# EAGLE design ISP_Arduino_Board (EAGLE 7.6.0)
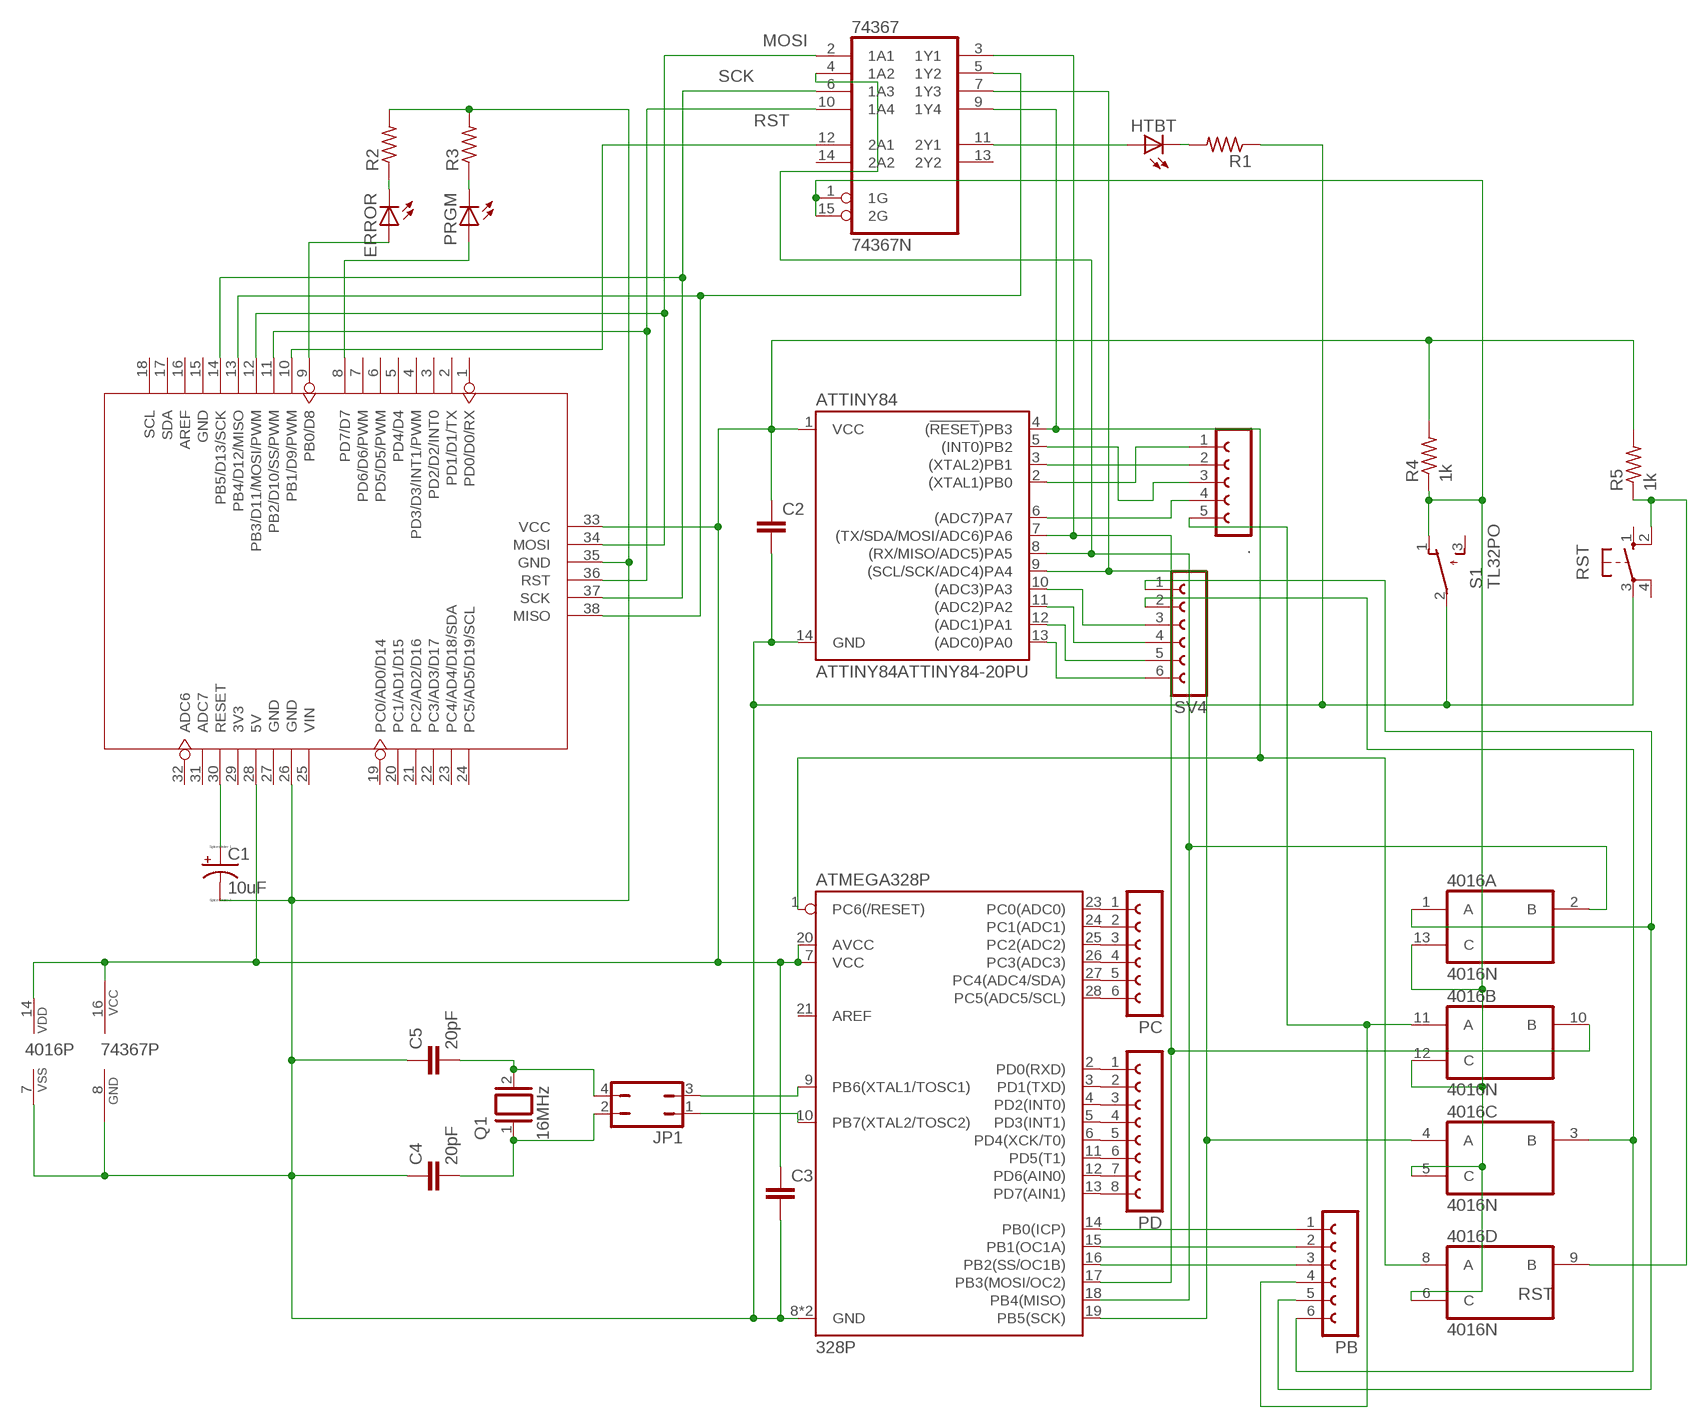
[diagram p0: schematic, sheet 1]

## Parts
4016  4016N  [DIL14]
74367  74367N  [DIL16]
.  FE05-1  [FE05-1]
ATMEGA328P  328P  ATMEGA328P_PDIP  [DIP28]
ATTINY84  ATTINY84ATTINY84-20PU  [DIP14]
C1  10uF  CPOL-USE2.5-6  [E2,5-6]
C2  C2,5-3  [C2.5-3]
C3  C2,5-3  [C2.5-3]
C4  20pF  C2,5-3  [C2.5-3]
C5  20pF  C2,5-3  [C2.5-3]
ERROR  LED3MM  [LED3MM]
HTBT  LED3MM  [LED3MM]
JP1  JP2Q  [JP2Q]
PB  FE06-1  [FE06]
PC  FE06-1  [FE06]
PD  FE08-1  [FE08]
PRGM  LED3MM  [LED3MM]
Q1  16MHz  XTAL/S  [QS]
R1  R-US_0207/10  [0207/10]
R2  R-US_0207/10  [0207/10]
R3  R-US_0207/10  [0207/10]
R4  1k  R-US_0207/10  [0207/10]
R5  1k  R-US_0207/10  [0207/10]
RST  10-XX  [B3F-10XX]
S1  TL32PO  [TL3XPO]
SV4  FE06-1  [FE06]
U2  DIP Long Blue Female Header  ARDUINO-38P  [ARDUINO-38P]

## Nets
GND: 4016.7(P:VSS) 74367.8(GND) ATMEGA328P.8(GND) ATMEGA328P.22(GND) ATTINY84.14(GND) C1.- C2.2 C3.2 C4.1 C5.1 R1.1 R2.2 R3.2 RST.3(P) S1.2(P) U2.26(GND) U2.35(GND)
N$1: 4016.14(P:VDD) 74367.16(VCC) ATMEGA328P.7(VCC) ATMEGA328P.20(AVCC) ATTINY84.1(VCC) C2.1 C3.1 R4.2 R5.2 U2.28(5V) U2.33(VCC)
N$2: 4016.11(B:A) ..5 PB.4
N$3: 4016.4(C:A) 74367.7(1Y3) ATMEGA328P.19(PB5(SCK)) ATTINY84.9((SCL/SCK/ADC4)PA4)
N$4: C1.+ U2.30(RESET)
N$5: 4016.2(A:B) 74367.4(1A2) ATMEGA328P.18(PB4(MISO)) ATTINY84.8((RX/MISO/ADC5)PA5)
N$6: ATMEGA328P.14(PB0(ICP)) PB.1
N$7: PRGM.K(C) R3.1
N$8: C5.2 JP1.4 Q1.2
N$10: ERROR.K(C) R2.1
N$11: HTBT.K(C) R1.2
N$12: 74367.12(2A1) U2.10(PB1/D9/PWM)
N$13: 74367.2(1A1) U2.12(PB3/D11/MOSI/PWM) U2.34(MOSI)
N$14: PRGM.A U2.8(PD7/D7)
N$15: 74367.9(1Y4) ATMEGA328P.1(PC6(/RESET)) ATTINY84.4((!RESET!)PB3)
N$16: C4.2 JP1.2 Q1.1
N$17: ATMEGA328P.9(PB6(XTAL1/TOSC1)) JP1.3
N$18: ATMEGA328P.10(PB7(XTAL2/TOSC2)) JP1.1
N$19: ERROR.A U2.9(PB0/D8)
N$20: 74367.10(1A4) U2.11(PB2/D10/SS/PWM) U2.36(RST)
N$21: 74367.5(1Y2) U2.13(PB4/D12/MISO) U2.38(MISO)
N$22: 74367.6(1A3) U2.14(PB5/D13/SCK) U2.37(SCK)
N$23: ATMEGA328P.2(PD0(RXD)) PD.1
N$24: ATMEGA328P.3(PD1(TXD)) PD.2
N$25: 4016.5(C:C) 4016.6(D:C) 4016.12(B:C) 4016.13(A:C) 74367.1(1G) 74367.15(2G) R4.1 S1.1(O)
N$26: ATMEGA328P.23(PC0(ADC0)) PC.1
N$27: ATMEGA328P.24(PC1(ADC1)) PC.2
N$28: ATMEGA328P.25(PC2(ADC2)) PC.3
N$29: ATMEGA328P.26(PC3(ADC3)) PC.4
N$30: ATMEGA328P.27(PC4(ADC4/SDA)) PC.5
N$31: ATMEGA328P.28(PC5(ADC5/SCL)) PC.6
N$32: ATMEGA328P.4(PD2(INT0)) PD.3
N$33: ATMEGA328P.5(PD3(INT1)) PD.4
N$34: ATMEGA328P.6(PD4(XCK/T0)) PD.5
N$35: ATMEGA328P.11(PD5(T1)) PD.6
N$36: ATMEGA328P.12(PD6(AIN0)) PD.7
N$37: ATMEGA328P.13(PD7(AIN1)) PD.8
N$38: ATMEGA328P.15(PB1(OC1A)) PB.2
N$39: ATMEGA328P.16(PB2(SS/OC1B)) PB.3
N$40: 4016.3(C:B) PB.6 SV4.2
N$41: 4016.1(A:A) PB.5 SV4.1
N$43: 4016.9(D:B) R5.1 RST.2(S1)
N$44: 74367.11(2Y1) HTBT.A
N$45: ..1 ATTINY84.2((XTAL1)PB0)
N$46: ..2 ATTINY84.3((XTAL2)PB1)
N$47: ..3 ATTINY84.5((INT0)PB2)
N$48: ..4 ATTINY84.6((ADC7)PA7)
N$49: ATTINY84.13((ADC0)PA0) SV4.6
N$50: ATTINY84.12((ADC1)PA1) SV4.5
N$51: ATTINY84.11((ADC2)PA2) SV4.4
N$52: ATTINY84.10((ADC3)PA3) SV4.3
PD: 4016.10(B:B) 74367.3(1Y1) ATMEGA328P.17(PB3(MOSI/OC2)) ATTINY84.7((TX/SDA/MOSI/ADC6)PA6)
Unconnected: 4016.8(D:A) 74367.13(2Y2) 74367.14(2A2) ATMEGA328P.21(AREF) RST.1(S) RST.4(P1) S1.3(S) U2.1(PD0/D0/RX) U2.2(PD1/D1/TX) U2.3(PD2/D2/INT0) U2.4(PD3/D3/INT1/PWM) U2.5(PD4/D4) U2.6(PD5/D5/PWM) U2.7(PD6/D6/PWM) U2.15(GND) U2.16(AREF) U2.17(SDA) U2.18(SCL) U2.19(PC0/AD0/D14) U2.20(PC1/AD1/D15) U2.21(PC2/AD2/D16) U2.22(PC3/AD3/D17) U2.23(PC4/AD4/D18/SDA) U2.24(PC5/AD5/D19/SCL) U2.25(VIN) U2.27(GND) U2.29(3V3) U2.31(ADC7) U2.32(ADC6)

## Notes on the sheet
- MOSI
- SCK
- RST
- RST

## Library data of the parts
4016 = 40xx:4016: Quad bilateral ANALOG SWITCH
74367 = 74xx-us:74*367: Hex BUS DRIVER, 3-state
. = con-lsta:FE05-1: FEMALE HEADER; OC_FARNELL: unknown; OC_NEWARK: unknown
ATMEGA328P = SparkFun-IC-Microcontroller:ATMEGA328P_PDIP: Atmel 328P Through hole ATMEGA328P uC used in the Arduino 32kb flash, 1k EEPROM, 2k SRAM Datasheet <http://www.sparkfun.com/datasheets/Components/SMD/ATMega328.pdf> SparkFun Products Storefront component: AVR 28 Pin 20MHz 32K 6A/D - ATMega328P <https://www.sparkfun.com/products/9061> (COM-09061) SparkFun Simon Says - Through-Hole Soldering Kit <https://www.sparkfun.com/products/10547> (KIT-10547) SparkFun Learn to Solder - Simon Says <https://www.sparkfun.com/products/13708> (KIT-13708) SparkFun BigTime Watch Kit <https://www.sparkfun.com/products/11734> (KIT-11734) SparkFun ClockIt <https://www.sparkfun.com/products/10930> (KIT-10930) SparkFun Serial Enabled LCD Kit <https://www.sparkfun.com/products/10097> (LCD-10097) SparkFun Simon Tilts - Through Hole Soldering Kit <https://www.sparkfun.com/products/12634> (KIT-12634) SparkFun Frequency Counter Kit <https://www.sparkfun.com/products/10140> (KIT-10140) FabFM Radio Kit <https://www.sparkfun.com/products/11043> (KIT-11043) SparkFun Binary Blaster Kit <https://www.sparkfun.com/products/12037> (KIT-12037) SparkFun Metro-Gnome <https://www.sparkfun.com/products/9236> (KIT-09236) ATmega328 with Arduino Optiboot (Uno) <https://www.sparkfun.com/products/10524> (DEV-10524); PROD_ID: IC-09136
ATTINY84 = SparkFun-IC-Microcontroller:ATTINY84: Atmel 14-pin 2/4/8kB flash uC Datasheet <https://cdn.sparkfun.com/datasheets/Widgets/doc8006.pdf> SparkFun Products Tiny AVR Programmer <https://www.sparkfun.com/products/11801> (PGM-11801) SparkFun Servo Trigger - Continuous Rotation <https://www.sparkfun.com/products/13872> (WIG-13872) SparkFun Servo Trigger <https://www.sparkfun.com/products/13118> (WIG-13118)
C1 = resistor:CPOL-US: POLARIZED CAPACITOR, American symbol
C2-C5 = capacitor-wima:C: CAPACITOR naming: grid - package width
ERROR HTBT PRGM = led:LED: LED OSRAM: - CHIPLED LG R971, LG N971, LY N971, LG Q971, LY Q971, LO R971, LY R971 LH N974, LH R974 LS Q976, LO Q976, LY Q976 LO Q996 - Hyper CHIPLED LW Q18S LB Q993, LB Q99A, LB R99A - SideLED LS A670, LO A670, LY A670, LG A670, LP A670 LB A673, LV A673, LT A673, LW A673 LH A674 LY A675 LS A676, LA A676, LO A676, LY A676, LW A676 LS A679, LY A679, LG A679 - Hyper Micro SIDELED® LS Y876, LA Y876, LO Y876, LY Y876 LT Y87S - SmartLED LW L88C, LW L88S LB L89C, LB L89S, LG L890 LS L89K, LO L89K, LY L89K LS L896, LA L896, LO L896, LY L896 - TOPLED LS T670, LO T670, LY T670, LG T670, LP T670 LSG T670, LSP T670, LSY T670, LOP T670, LYG T670 LG T671, LOG T671, LSG T671 LB T673, LV T673, LT T673, LW T673 LH T674 LS T676, LA T676, LO T676, LY T676, LB T676, LH T676, LSB T676, LW T676 LB T67C, LV T67C, LT T67C, LS T67K, LO T67K, LY T67K, LW E67C LS E67B, LA E67B, LO E67B, LY E67B, LB E67C, LV E67C, LT E67C LW T67C LS T679, LY T679, LG T679 LS T770, LO T770, LY T770, LG T770, LP T770 LB T773, LV T773, LT T773, LW T773 LH T774 LS E675, LA E675, LY E675, LS T675 LS T776, LA T776, LO T776, LY T776, LB T776 LHGB T686 LT T68C, LB T68C - Hyper Mini TOPLED® LB M676 - Mini TOPLED Santana® LG M470 LS M47K, LO M47K, LY M47K Source: http://www.osram.convergy.de LUXEON: - LUMILED® LXK2-PW12-R00, LXK2-PW12-S00, LXK2-PW14-U00, LXK2-PW14-V00 LXK2-PM12-R00, LXK2-PM12-S00, LXK2-PM14-U00 LXK2-PE12-Q00, LXK2-PE12-R00, LXK2-PE12-S00, LXK2-PE14-T00, LXK2-PE14-U00 LXK2-PB12-K00, LXK2-PB12-L00, LXK2-PB12-M00, LXK2-PB14-N00, LXK2-PB14-P00, LXK2-PB14-Q00 LXK2-PR12-L00, LXK2-PR12-M00, LXK2-PR14-Q00, LXK2-PR14-R00 LXK2-PD12-Q00, LXK2-PD12-R00, LXK2-PD12-S00 LXK2-PH12-R00, LXK2-PH12-S00 LXK2-PL12-P00, LXK2-PL12-Q00, LXK2-PL12-R00 Source: www.luxeon.com KINGBRIGHT: KA-3528ASYC Source: www.kingbright.com
JP1 = jumper:JP2Q: JUMPER
PB PC SV4 = con-lsta:FE06-1: FEMALE HEADER; OC_FARNELL: unknown; OC_NEWARK: unknown
PD = con-lsta:FE08-1: FEMALE HEADER; OC_FARNELL: unknown; OC_NEWARK: unknown
Q1 = special:XTAL/S: CRYSTAL
R1-R5 = resistor:R-US_: RESISTOR, American symbol
RST = switch-omron:10-XX: OMRON SWITCH; MPN: B3F-1000; OC_FARNELL: 176432; OC_NEWARK: 36M3542
S1 = switch:TL32PO: TINY SWITCH ON - MOM Source: http://www2.produktinfo.conrad.com/datenblaetter/700000-724999/705152-da-01-de-Subminiaturschalter_TL_36YO.pdf
U2 = moudle:ARDUINO-38P

## Net classes
0 default: width 0.203 mm, drill 0.305 mm, clearance 0.152 mm
3 usbvcc: width 0.203 mm, drill 0.305 mm, clearance 0.203 mm

## Board
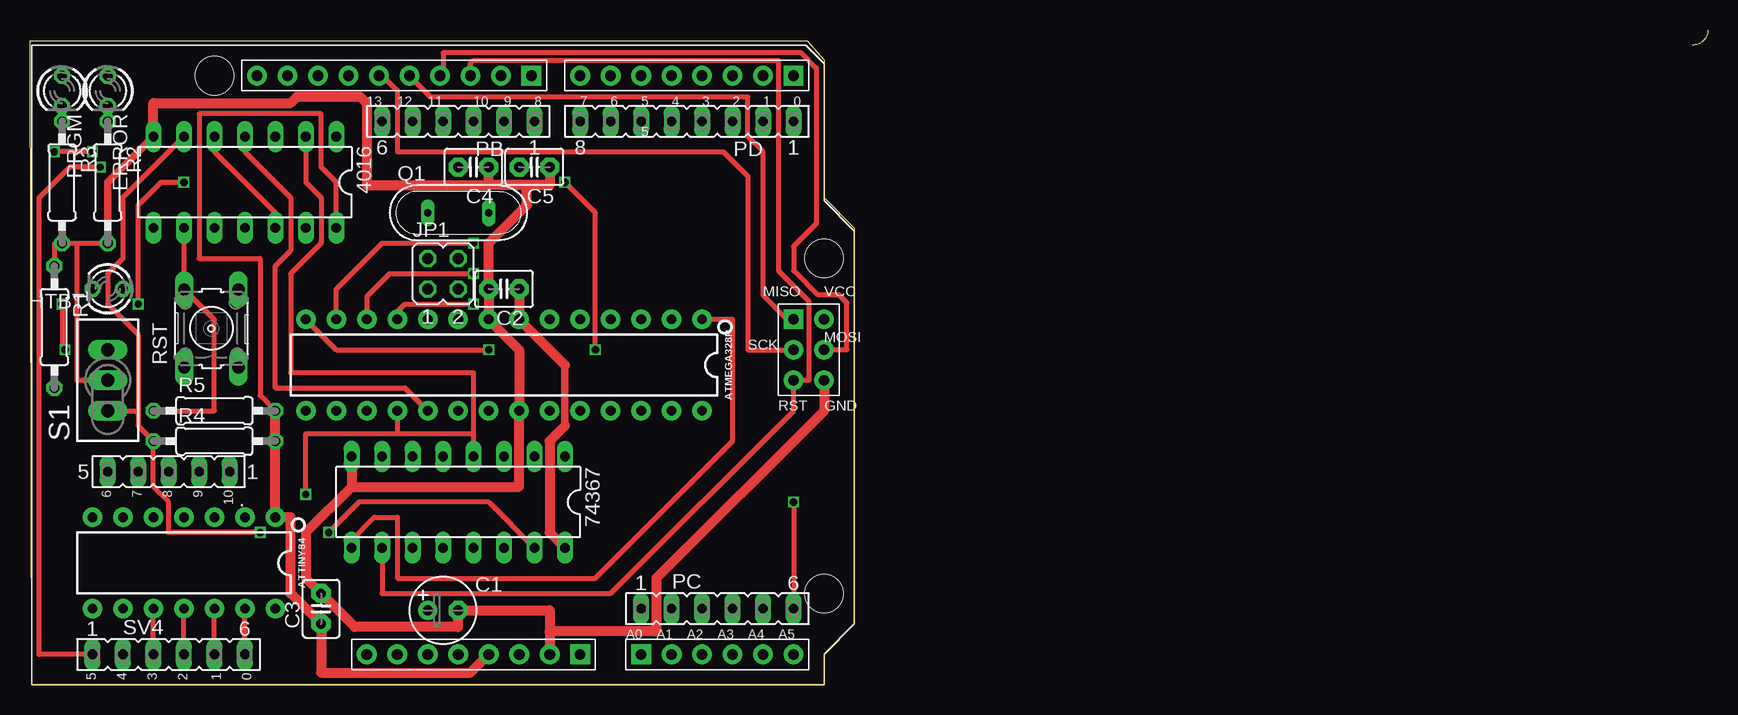
[diagram p1: board, top side]
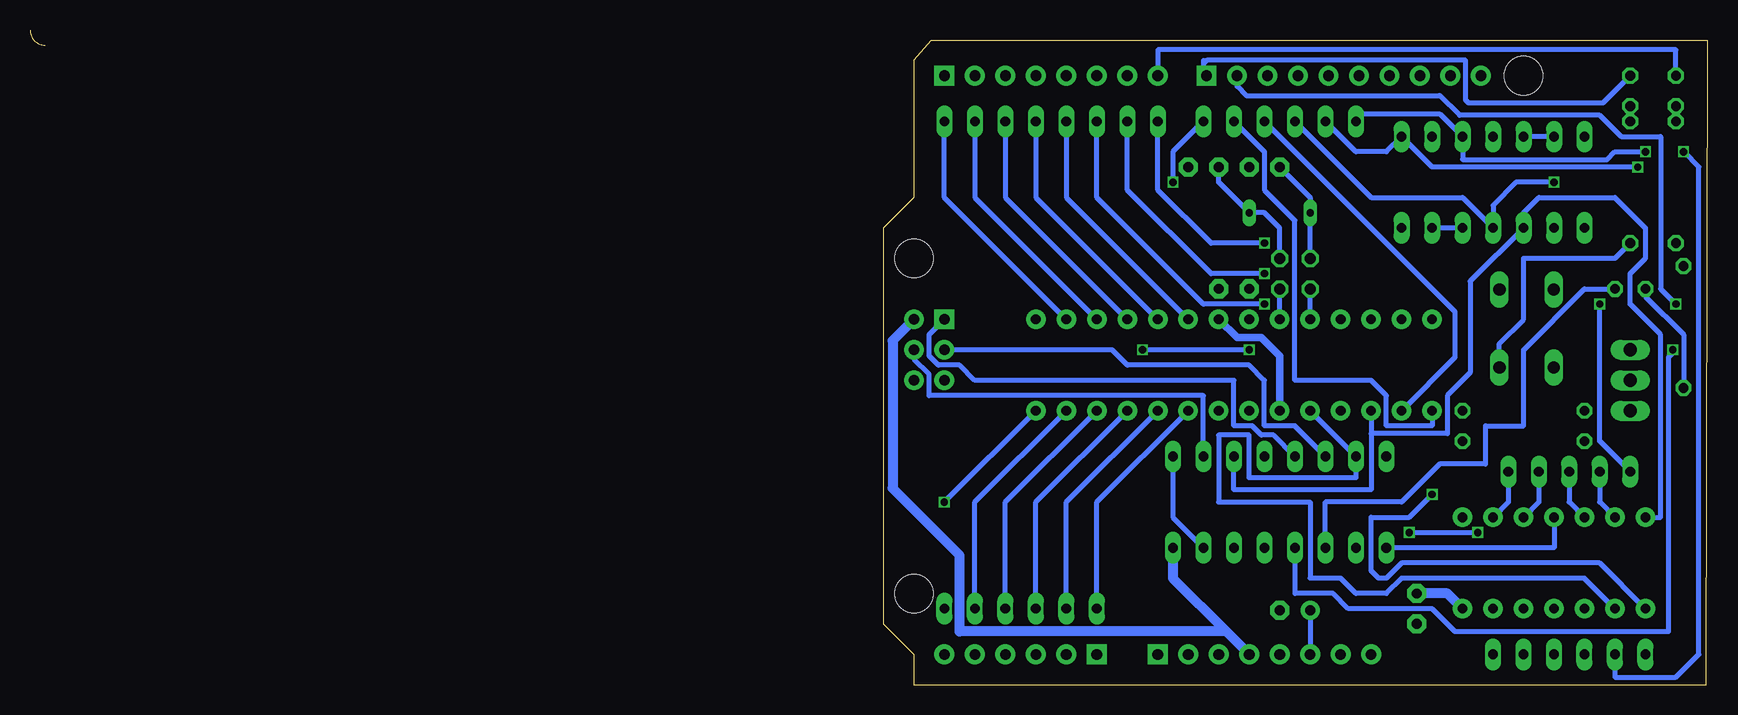
[diagram p2: board, bottom side, seen from below]

Size 139.83 x 54.61 mm. Coordinates in mm from the lower left corner, seen from the top.
Outline: 139.83,54.61 arc-90 138.56,53.34
Outline: 0,53.72 64.77,53.72 66.17,52.07 66.17,40.64 68.71,38.1 68.71,5.08 66.17,2.54 66.17,0 0.13,0 0,53.72
Copper layers (1*16): Top 0.035mm / dielectric 1.5mm / Bottom 0.035mm
Design rules "SeeedStudio_rule_no_angle_090911 *": minimum track width 6mil, minimum drill 12mil, track to track 6mil, track to pad 6mil, pad to pad 6mil, via to via 6mil, smd to smd 0mil, copper to edge 10mil, drill to drill 10mil, minimum pad ring 10mil, minimum via ring 6mil, stop-mask expansion 2mil, vias tented up to drill 100mil, thermal gap 10mil

### Footprints (pad centres in the part's own frame; a part is rotated, then mirrored left to right if it is on the bottom)
DIL14 = drill 0.813 long: 1 -7.62,-3.81; 2 -5.08,-3.81; 3 -2.54,-3.81; 4 0,-3.81; 5 2.54,-3.81; 6 5.08,-3.81; 7 7.62,-3.81; 8 7.62,3.81; 9 5.08,3.81; 10 2.54,3.81; 11 0,3.81; 12 -2.54,3.81; 13 -5.08,3.81; 14 -7.62,3.81
DIL16 = drill 0.813 long: 1 -8.89,-3.81; 2 -6.35,-3.81; 3 -3.81,-3.81; 4 -1.27,-3.81; 5 1.27,-3.81; 6 3.81,-3.81; 7 6.35,-3.81; 8 8.89,-3.81; 9 8.89,3.81; 10 6.35,3.81; 11 3.81,3.81; 12 1.27,3.81; 13 -1.27,3.81; 14 -3.81,3.81; 15 -6.35,3.81; 16 -8.89,3.81
FE05-1 = drill 0.813 long: 1 -5.08,0; 2 -2.54,0; 3 0,0; 4 2.54,0; 5 5.08,0
DIP28 = drill 0.813 pad 1.626: 1 -16.51,-3.81; 2 -13.97,-3.81; 3 -11.43,-3.81; 4 -8.89,-3.81; 5 -6.35,-3.81; 6 -3.81,-3.81; 7 -1.27,-3.81; 8 1.27,-3.81; 9 3.81,-3.81; 10 6.35,-3.81; 11 8.89,-3.81; 12 11.43,-3.81; 13 13.97,-3.81; 14 16.51,-3.81; 15 16.51,3.81; 16 13.97,3.81; 17 11.43,3.81; 18 8.89,3.81; 19 6.35,3.81; 20 3.81,3.81; 21 1.27,3.81; 22 -1.27,3.81; 23 -3.81,3.81; 24 -6.35,3.81; 25 -8.89,3.81; 26 -11.43,3.81; 27 -13.97,3.81; 28 -16.51,3.81
DIP14 = drill 0.813 pad 1.626: 1 -7.62,-3.81; 2 -5.08,-3.81; 3 -2.54,-3.81; 4 0,-3.81; 5 2.54,-3.81; 6 5.08,-3.81; 7 7.62,-3.81; 8 7.62,3.81; 9 5.08,3.81; 10 2.54,3.81; 11 0,3.81; 12 -2.54,3.81; 13 -5.08,3.81; 14 -7.62,3.81
E2,5-6 = drill 0.813 pad 1.6: + -1.27,0 | drill 0.813 pad 1.6 octagon: - 1.27,0
C2.5-3 = drill 0.813 pad 1.6 octagon: 1 -1.27,0; 2 1.27,0
LED3MM = drill 0.813 octagon: A -1.27,0; K 1.27,0
JP2Q = drill 0.914 octagon: 1 -1.27,-1.27; 2 -1.27,1.27; 3 1.27,-1.27; 4 1.27,1.27
FE06 = drill 0.813 long: 1 -6.35,0; 2 -3.81,0; 3 -1.27,0; 4 1.27,0; 5 3.81,0; 6 6.35,0
FE08 = drill 0.813 long: 1 -8.89,0; 2 -6.35,0; 3 -3.81,0; 4 -1.27,0; 5 1.27,0; 6 3.81,0; 7 6.35,0; 8 8.89,0
QS = drill 0.61 long: 1 -2.54,0; 2 2.54,0
0207/10 = drill 0.813 octagon: 1 -5.08,0; 2 5.08,0
B3F-10XX = drill 1.016 long: 1 -3.251,2.261; 2 3.251,2.261; 3 -3.251,-2.261; 4 3.251,-2.261
TL3XPO = drill 1.1 pad 1.422 long: 1 -2.54,0; 2 0,0; 3 2.54,0
ARDUINO-38P = drill 0.889 pad 1.651 square: 1 63.5,50.8; 9 41.656,50.8; 19 50.8,2.54; 25 45.72,2.54; 38 63.5,30.48 | drill 0.889 pad 1.651: 2 60.96,50.8; 3 58.42,50.8; 4 55.88,50.8; 5 53.34,50.8; 6 50.8,50.8; 7 48.26,50.8; 8 45.72,50.8; 10 39.116,50.8; 11 36.576,50.8; 12 34.036,50.8; 13 31.496,50.8; 14 28.956,50.8; 15 26.416,50.8; 16 23.876,50.8; 17 21.336,50.8; 18 18.796,50.8; 20 53.34,2.54; 21 55.88,2.54; 22 58.42,2.54; 23 60.96,2.54; 24 63.5,2.54; 26 43.18,2.54; 27 40.64,2.54; 28 38.1,2.54; 29 35.56,2.54; 30 33.02,2.54; 31 30.48,2.54; 32 27.94,2.54; 33 66.04,30.48; 34 66.04,27.94; 35 66.04,25.4; 36 63.5,25.4; 37 63.5,27.94 | hole 3.2: 15.24,50.8; 66.04,35.56; 66.04,7.62

### Placement (x,y rotation side)
4016  17.91,41.91 180 top
74367  35.69,15.24 180 top
.  11.56,17.78 180 top
ATMEGA328P  39.5,26.67 180 top
ATTINY84  12.83,10.16 180 top
C1  34.42,6.22 0 top
C2  39.5,33.02 180 top
C3  24.26,6.35 90 top
C4  36.96,43.18 180 top
C5  42.04,43.18 180 top
ERROR  6.48,49.53 270 top
HTBT  6.48,33.02 180 top
JP1  34.42,34.29 0 top
PB  35.69,46.99 180 top
PC  57.28,6.35 0 top
PD  54.74,46.99 180 top
PRGM  2.67,49.53 270 top
Q1  35.69,39.37 0 top
R1  2.03,29.84 270 top
R2  6.48,41.91 270 top
R3  2.67,41.91 270 top
R4  15.37,20.32 0 top
R5  15.37,22.86 0 top
RST  15.11,29.72 90 top
S1  6.48,25.4 90 top
SV4  11.56,2.54 0 top
U2  0.13,0 0 top

### Tracks (layer width: path | path; a pad name or v marks a point on that pad's centre or on a via)
GND
  Top 0.406: 3.94,36.83 R3.2 2.03,36.83 R1.1 | 3.94,36.83 R2.2 | 3.94,36.83 3.94,25.4 S1.2
  Top 0.61: R2.2 6.48,41.91 4016.7
  Top 0.813: 43.31,4.45 43.31,6.22 C1.- 35.69,4.83 27.05,4.83 C3.2 22.99,8.89 22.99,12.7 26.8,16.51 | 43.31,4.45 U2.26 | C5.1 43.31,41.66 41.4,41.66 | 41.4,41.66 38.23,41.66 | 38.23,41.66 C4.1 | 38.23,41.66 28.07,41.66 28.07,48.51 27.56,49.02 22.22,49.02 21.72,48.51 10.29,48.51 4016.7 | U2.35 66.17,22.86 52.2,8.89 52.2,4.45 43.31,4.45 | 74367.8 26.8,16.51 | 26.8,16.51 40.77,16.51 ATMEGA328P.22 40.77,27.94 ATMEGA328P.8 C2.2 38.23,36.83 41.4,40.01 41.4,41.66
  Bottom 0.406: RST.3 17.37,28.47 15.37,30.48 15.37,35.56 7.75,35.56 R2.2
  Bottom 0.813: ATTINY84.14 21.72,7.62 C3.2
N$1
  Top 0.406: 4016.14 25.53,41.91 24.26,43.18 24.26,47.62 14.1,47.62 14.1,35.56 19.18,35.56 19.18,24.13 R5.2
  Top 0.61: 44.58,26.67 44.58,21.59
  Top 0.813: R5.2 R4.2 ATTINY84.1 21.72,13.97 21.72,7.62 C3.1 24.26,1.02 36.7,1.02 U2.28 | 44.58,21.59 43.31,20.32 43.31,12.7 74367.16 | C2.1 ATMEGA328P.7 44.58,26.67
  Bottom 0.61: ATMEGA328P.7 39.24,28.96 37.21,28.96 35.69,27.43 ATMEGA328P.20
  Bottom 0.813: 74367.16 44.58,8.89 40.13,4.45 | U2.28 40.13,4.45 | 40.13,4.45 62.36,4.45 62.36,10.79 67.94,16.38 67.94,28.7 U2.33
N$2  (via drill 0.6)
  Top 0.406: v9.02,31.75 9.02,40.01 10.92,41.91 v12.83,41.91
  Bottom 0.406: PB.4 28.07,40.64 20.45,40.64 4016.11 17.91,40.01 16,41.91 v12.83,41.91 | ..5 9.02,20.32 v9.02,31.75
N$3
  Top 0.406: 4016.4 17.91,44.45 21.72,40.64 21.72,36.2 20.45,34.92 20.45,24.77 31.24,24.77 ATMEGA328P.19
  Bottom 0.406: ATMEGA328P.19 74367.7 29.34,17.27 38.23,17.27 38.23,20.83 40.77,20.83 40.77,15.24 33.15,15.24 33.15,8.89 30.61,8.89 29.34,7.62 26.8,7.62 25.53,8.89 10.29,8.89 ATTINY84.9
N$4
  Bottom 0.406: C1.+ U2.30
N$5  (via drill 0.6)
  Top 0.406: 4016.2 22.99,41.91 24.26,40.64 24.26,36.83 21.72,34.29 21.72,26.04 36.96,26.04 36.96,20.95 | ATMEGA328P.18 30.61,20.95 | 30.61,20.95 36.96,20.95 | v22.99,15.88 22.99,20.95 30.61,20.95 | 36.96,20.95 74367.4
  Bottom 0.406: ATTINY84.8 9.02,10.16 25.53,10.16 26.8,8.89 27.43,8.89 28.07,9.53 28.07,13.97 24.89,13.97 v22.99,15.88
N$6  (via drill 0.6)
  Top 0.406: v38.23,27.94 25.53,27.94 ATMEGA328P.14 | v47.12,27.94 47.12,39.37 v44.58,41.91
  Bottom 0.406: v38.23,27.94 v47.12,27.94 | PB.1 44.58,44.45 v44.58,41.91
N$7
  Bottom 0.406: PRGM.K R3.1
N$8
  Bottom 0.406: C5.2 40.77,41.91 Q1.2 36.96,39.37 35.69,38.1 JP1.4
N$10
  Bottom 0.406: ERROR.K R2.1
N$11
  Bottom 0.406: HTBT.K 5.21,32.38 2.03,29.21 R1.2
N$12  (via drill 0.6)
  Top 0.406: v2.67,31.75 2.67,28.19 v2.92,27.94
  Bottom 0.406: 74367.12 34.42,7.62 31.24,7.62 29.97,6.35 22.99,6.35 21.08,4.45 3.3,4.45 3.3,27.3 2.92,27.69 v2.92,27.94 | U2.10 39.24,49.91 38.48,49.15 22.35,49.15 20.7,47.5 9.02,47.5 7.24,45.72 3.94,45.72 3.94,33.02 v2.67,31.75
N$13
  Top 0.406: U2.34 68.07,27.94 68.07,31.88 67.44,32.51 65.66,32.51 63.63,34.54 63.63,36.58 65.53,38.48 65.53,51.44 64.26,52.7 34.42,52.7 34.42,51.05 U2.12
  Bottom 0.406: 74367.2 42.04,24.13 64.9,24.13 64.9,25.91 66.17,27.18 U2.34
N$14
  Bottom 0.406: PRGM.A 2.67,52.96 45.85,52.96 U2.8
N$15
  Top 0.406: ATMEGA328P.1 58.55,30.48 58.55,20.32 47.12,8.89 30.61,8.89 30.61,13.97 28.7,13.97 26.8,12.06 74367.9
  Bottom 0.406: ATTINY84.4 12.83,11.43 74367.9
N$16
  Bottom 0.406: JP1.2 Q1.1 33.15,40.64 C4.2
N$17
  Bottom 0.406: ATMEGA328P.9 JP1.3
N$18
  Bottom 0.406: ATMEGA328P.10 JP1.1
N$19
  Bottom 0.406: 42.04,52.07 42.04,51.82 | 42.04,51.82 42.04,51.05 U2.9 | ERROR.A 8.76,48.51 19.94,48.51 20.19,48.77 20.19,52.07 41.78,52.07 42.04,51.82
N$20
  Top 0.406: U2.11 36.7,51.82 36.96,52.07 62.36,52.07 62.36,34.54 64.9,32 64.9,25.4 U2.36 63.63,22.86 48.39,7.62 29.34,7.62 74367.10
N$21
  Top 0.406: U2.13 33.4,49.02 59.82,49.02 59.82,45.72 61.09,44.45 61.09,32.51 63.12,30.48 U2.38
  Bottom 0.406: 74367.5 36.2,20.83 37.21,20.83 37.97,21.59 39.5,21.59 39.5,25.4 61.09,25.4 62.36,26.67 64.13,26.67 64.9,27.43 64.9,29.21 U2.38
N$22
  Top 0.406: U2.14 29.34,50.8 30.61,49.53 30.61,44.45 57.79,44.45 59.82,42.42 59.82,27.94 U2.37
  Bottom 0.406: 74367.6 34.42,21.59 36.96,21.59 36.96,25.4 38.23,26.67 48.39,26.67 49.66,27.94 U2.37
N$23
  Bottom 0.406: ATMEGA328P.2 63.63,40.64 PD.1
N$24
  Bottom 0.406: PD.2 61.09,40.64 ATMEGA328P.3
N$25  (via drill 0.6)
  Top 0.406: 4016.6 7.75,40.64 7.75,35.56 6.48,34.29 6.48,31.75 9.02,29.21 9.02,22.86 | 4016.5 15.37,44.45 20.45,39.37 4016.12 | v24.89,12.7 27.43,15.24 38.23,15.24 74367.15 | v19.18,12.7 11.56,12.7 11.56,15.24 10.29,16.51 R4.1 9.02,21.59 9.02,22.61 9.02,22.86 | S1.1 9.02,22.86
  Bottom 0.406: 4016.12 4016.13 | 4016.6 4016.5 | 74367.1 44.58,13.97 74367.15 | v24.89,12.7 v19.18,12.7
N$26
  Bottom 0.406: PC.1 50.93,15.24 ATMEGA328P.23
N$27
  Bottom 0.406: PC.2 53.47,15.24 ATMEGA328P.24
N$28
  Bottom 0.406: PC.3 56.01,15.24 ATMEGA328P.25
N$29
  Bottom 0.406: PC.4 58.55,15.24 ATMEGA328P.26
N$30
  Bottom 0.406: PC.5 61.09,15.24 ATMEGA328P.27
N$31  (via drill 0.6)
  Top 0.406: v63.63,15.24 PC.6
  Bottom 0.406: ATMEGA328P.28 v63.63,15.24
N$32
  Bottom 0.406: PD.3 58.55,40.64 ATMEGA328P.4
N$33
  Bottom 0.406: PD.4 56.01,40.64 ATMEGA328P.5
N$34
  Bottom 0.406: PD.5 53.47,40.64 ATMEGA328P.6
N$35  (via drill 0.6)
  Top 0.406: ATMEGA328P.11 30.61,31.11 31.24,31.75 v36.96,31.75
  Bottom 0.406: PD.6 50.93,40.64 42.04,31.75 v36.96,31.75
N$36  (via drill 0.6)
  Top 0.406: v36.96,34.29 29.97,34.29 28.07,32.38 ATMEGA328P.12
  Bottom 0.406: v36.96,34.29 41.4,34.29 48.39,41.27 PD.7
N$37  (via drill 0.6)
  Top 0.406: ATMEGA328P.13 25.53,33.02 29.34,36.83 v36.96,36.83
  Bottom 0.406: v36.96,36.83 41.4,36.83 45.85,41.27 PD.8
N$38
  Bottom 0.406: ATMEGA328P.15 22.99,21.59 26.8,21.59 26.8,24.13 28.07,25.4 34.42,25.4 34.42,38.73 36.96,41.27 36.96,44.45 PB.2
N$39
  Bottom 0.406: PB.3 21.08,31.11 21.08,27.3 ATMEGA328P.16
N$40  (via drill 0.6)
  Top 0.406: v5.21,44.45 v2.03,44.45
  Bottom 0.406: PB.6 28.7,47.62 22.35,47.62 4016.3 20.45,43.81 8.38,43.81 7.75,44.45 v5.21,44.45 | SV4.2 7.75,0.64 2.67,0.64 0.76,2.54 0.76,43.18 v2.03,44.45
N$41  (via drill 0.6)
  Top 0.406: SV4.1 0.76,2.54 0.76,40.64 3.3,43.18 v5.84,43.18
  Bottom 0.406: PB.5 29.34,44.45 26.8,44.45 4016.1 22.99,43.18 v5.84,43.18
N$43
  Top 0.406: R5.1 15.37,22.86 15.37,30.45 RST.2 12.85,38.08 4016.9
N$44
  Bottom 0.406: 74367.11 31.88,15.24 25.53,15.24 22.35,18.41 18.54,18.41 18.54,21.59 15.37,21.59 15.37,27.94 10.29,33.02 HTBT.A
N$45
  Bottom 0.406: ..1 16.64,15.24 ATTINY84.2
N$46
  Bottom 0.406: ..2 14.1,15.24 ATTINY84.3
N$47
  Bottom 0.406: ..3 11.56,15.24 ATTINY84.5
N$48
  Bottom 0.406: ..4 9.02,15.24 ATTINY84.6
N$49
  Top 0.406: SV4.6 ATTINY84.13
N$50
  Top 0.406: SV4.5 ATTINY84.12
N$51
  Top 0.406: SV4.4 ATTINY84.11
N$52
  Top 0.406: SV4.3 ATTINY84.10
PD
  Bottom 0.406: ATTINY84.7 3.94,13.97 3.94,29.21 6.48,31.75 6.48,34.29 5.21,35.56 5.21,38.1 7.75,40.64 14.1,40.64 15.37,39.37 4016.10 19.81,33.66 19.81,26.04 21.72,24.13 21.72,20.95 28.07,20.95 | ATMEGA328P.17 28.07,20.95 | 28.07,20.95 28.07,16.26 39.5,16.26 74367.3

### Text on the board
tPlace: 13 | 12 | 11 | 10 | 9 | 8 | 7 | 6 | 5 | 4 | 5 | MISO | VCC | MOSI | SCK | RST | GND
tNames: 3 | 2 | 1 | 0 | 6 | 7 | 8 | 9 | 10 | A0 | A1 | A2 | A3 | A4 | A5 | 5 | 4 | 3 | 2 | 1 | 0
bPlate: A0 | A2 | A4 | SPI | UART